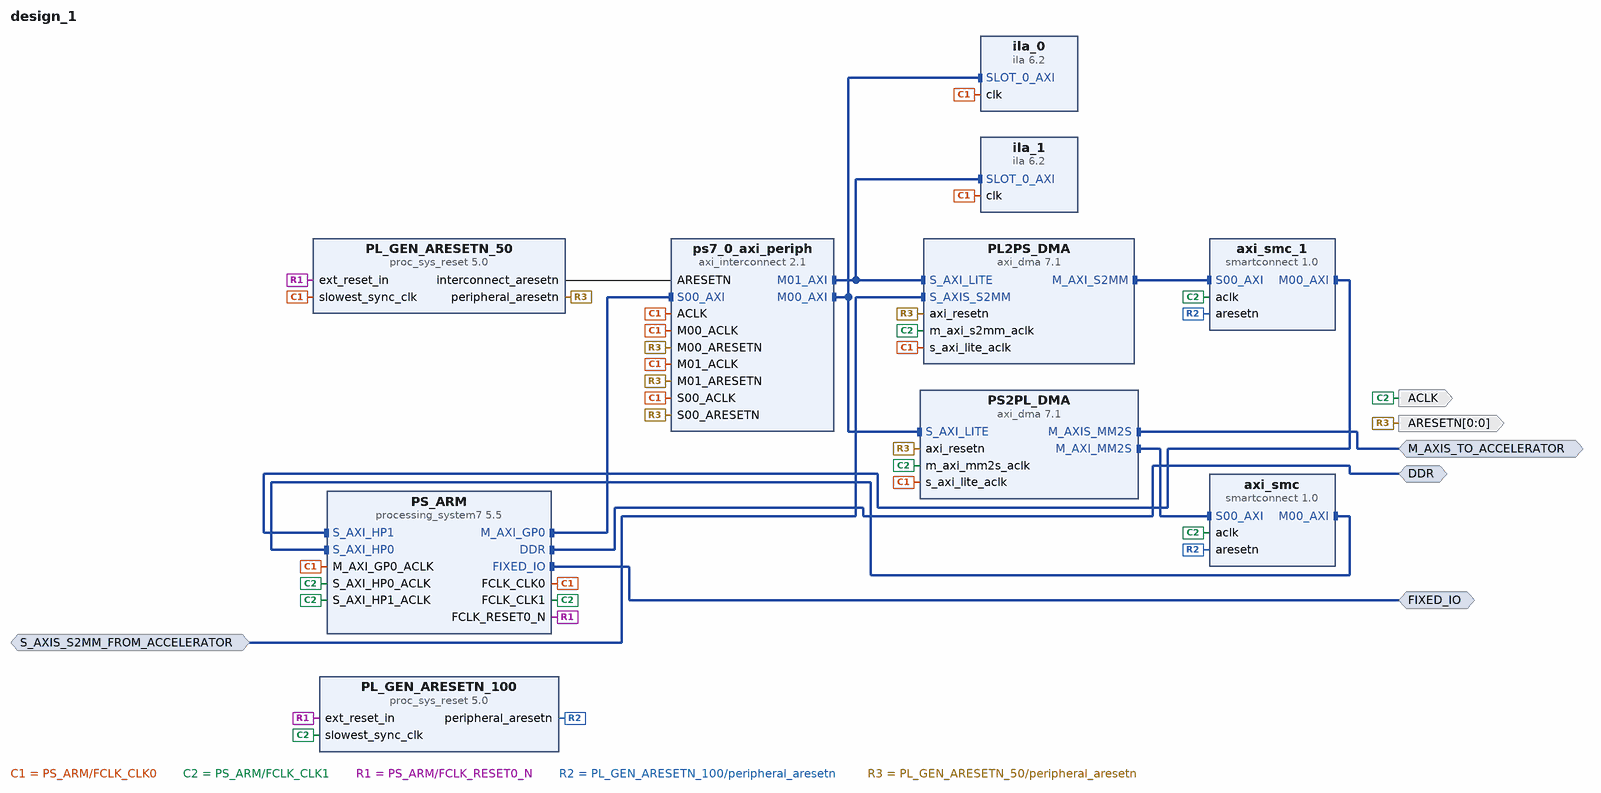
[diagram p0: block diagram of the top level]
# Vivado block design design_1, xc7z010clg400-1, Vivado 2022.2.2
create_bd_design design_1

create_bd_intf_port -mode Master -vlnv xilinx.com:interface:ddrx_rtl:1.0 DDR
create_bd_intf_port -mode Master -vlnv xilinx.com:display_processing_system7:fixedio_rtl:1.0 FIXED_IO
create_bd_intf_port -mode Master -vlnv xilinx.com:interface:axis_rtl:1.0 M_AXIS_TO_ACCELERATOR
create_bd_intf_port -mode Slave -vlnv xilinx.com:interface:axis_rtl:1.0 S_AXIS_S2MM_FROM_ACCELERATOR
set_property -dict [list \
  CONFIG.HAS_TKEEP 1 \
  CONFIG.HAS_TLAST 1 \
  CONFIG.HAS_TREADY 1 \
  CONFIG.HAS_TSTRB 0 \
  CONFIG.LAYERED_METADATA undef \
  CONFIG.TDATA_NUM_BYTES 4 \
  CONFIG.TDEST_WIDTH 0 \
  CONFIG.TID_WIDTH 0 \
  CONFIG.TUSER_WIDTH 0 \
] [get_bd_intf_ports S_AXIS_S2MM_FROM_ACCELERATOR]
create_bd_port -dir O -type clk ACLK
set_property -dict {CONFIG.ASSOCIATED_BUSIF M_AXIS_TO_ACCELERATOR:S_AXIS_S2MM_FROM_ACCELERATOR} [get_bd_ports ACLK]
create_bd_port -dir O -from 0 -to 0 -type rst ARESETN

create_bd_cell -type ip -vlnv xilinx.com:ip:axi_dma:7.1 PL2PS_DMA
set_property -dict [list \
  CONFIG.c_addr_width 64 \
  CONFIG.c_include_mm2s 0 \
  CONFIG.c_include_sg 0 \
  CONFIG.c_s2mm_burst_size 256 \
  CONFIG.c_sg_length_width 26 \
] [get_bd_cells PL2PS_DMA]
create_bd_cell -type ip -vlnv xilinx.com:ip:proc_sys_reset:5.0 PL_GEN_ARESETN_50
create_bd_cell -type ip -vlnv xilinx.com:ip:proc_sys_reset:5.0 PL_GEN_ARESETN_100
create_bd_cell -type ip -vlnv xilinx.com:ip:axi_dma:7.1 PS2PL_DMA
set_property -dict [list \
  CONFIG.c_addr_width 64 \
  CONFIG.c_include_s2mm 0 \
  CONFIG.c_include_sg 0 \
  CONFIG.c_m_axi_mm2s_data_width 64 \
  CONFIG.c_m_axis_mm2s_tdata_width 8 \
  CONFIG.c_mm2s_burst_size 256 \
  CONFIG.c_sg_length_width 26 \
] [get_bd_cells PS2PL_DMA]
create_bd_cell -type ip -vlnv xilinx.com:ip:processing_system7:5.5 PS_ARM
set_property -dict [list \
  CONFIG.PCW_APU_PERIPHERAL_FREQMHZ 650 \
  CONFIG.PCW_CRYSTAL_PERIPHERAL_FREQMHZ 50.000000 \
  CONFIG.PCW_ENET0_ENET0_IO {MIO 16 .. 27} \
  CONFIG.PCW_ENET0_GRP_MDIO_ENABLE 1 \
  CONFIG.PCW_ENET0_GRP_MDIO_IO EMIO \
  CONFIG.PCW_ENET0_PERIPHERAL_ENABLE 1 \
  CONFIG.PCW_ENET0_RESET_ENABLE 0 \
  CONFIG.PCW_ENET_RESET_ENABLE 1 \
  CONFIG.PCW_ENET_RESET_SELECT {Share reset pin} \
  CONFIG.PCW_EN_CLK1_PORT 1 \
  CONFIG.PCW_FCLK_CLK1_BUF TRUE \
  CONFIG.PCW_FPGA0_PERIPHERAL_FREQMHZ 50 \
  CONFIG.PCW_FPGA1_PERIPHERAL_FREQMHZ 100 \
  CONFIG.PCW_FPGA_FCLK1_ENABLE 1 \
  CONFIG.PCW_GPIO_MIO_GPIO_ENABLE 1 \
  CONFIG.PCW_GPIO_MIO_GPIO_IO MIO \
  CONFIG.PCW_I2C_RESET_ENABLE 1 \
  CONFIG.PCW_PRESET_BANK1_VOLTAGE {LVCMOS 1.8V} \
  CONFIG.PCW_QSPI_GRP_FBCLK_ENABLE 1 \
  CONFIG.PCW_QSPI_GRP_FBCLK_IO {MIO 8} \
  CONFIG.PCW_QSPI_GRP_SINGLE_SS_ENABLE 1 \
  CONFIG.PCW_QSPI_GRP_SINGLE_SS_IO {MIO 1 .. 6} \
  CONFIG.PCW_QSPI_PERIPHERAL_ENABLE 1 \
  CONFIG.PCW_QSPI_QSPI_IO {MIO 1 .. 6} \
  CONFIG.PCW_SD0_GRP_CD_ENABLE 1 \
  CONFIG.PCW_SD0_GRP_CD_IO {MIO 47} \
  CONFIG.PCW_SD0_GRP_WP_ENABLE 1 \
  CONFIG.PCW_SD0_GRP_WP_IO EMIO \
  CONFIG.PCW_SD0_PERIPHERAL_ENABLE 1 \
  CONFIG.PCW_SD0_SD0_IO {MIO 40 .. 45} \
  CONFIG.PCW_SDIO_PERIPHERAL_FREQMHZ 50 \
  CONFIG.PCW_SINGLE_QSPI_DATA_MODE x4 \
  CONFIG.PCW_UART1_PERIPHERAL_ENABLE 1 \
  CONFIG.PCW_UART1_UART1_IO {MIO 48 .. 49} \
  CONFIG.PCW_UART_PERIPHERAL_FREQMHZ 100 \
  CONFIG.PCW_UIPARAM_DDR_FREQ_MHZ 525 \
  CONFIG.PCW_UIPARAM_DDR_PARTNO {MT41K128M16 JT-125} \
  CONFIG.PCW_USB0_PERIPHERAL_ENABLE 1 \
  CONFIG.PCW_USB0_RESET_ENABLE 1 \
  CONFIG.PCW_USB0_RESET_IO {MIO 46} \
  CONFIG.PCW_USB0_USB0_IO {MIO 28 .. 39} \
  CONFIG.PCW_USB_RESET_ENABLE 1 \
  CONFIG.PCW_USB_RESET_SELECT {Share reset pin} \
  CONFIG.PCW_USE_S_AXI_HP0 1 \
  CONFIG.PCW_USE_S_AXI_HP1 1 \
] [get_bd_cells PS_ARM]
# 216 more settings of PS_ARM are not shown: defaults, MIO pin electricals, DDR timing, and values the tool derives
create_bd_cell -type ip -vlnv xilinx.com:ip:smartconnect:1.0 axi_smc
set_property -dict {CONFIG.NUM_SI 1} [get_bd_cells axi_smc]
create_bd_cell -type ip -vlnv xilinx.com:ip:smartconnect:1.0 axi_smc_1
set_property -dict {CONFIG.NUM_SI 1} [get_bd_cells axi_smc_1]
create_bd_cell -type ip -vlnv xilinx.com:ip:axi_interconnect:2.1 ps7_0_axi_periph
set_property -dict {CONFIG.NUM_MI 2} [get_bd_cells ps7_0_axi_periph]
create_bd_cell -type ip -vlnv xilinx.com:ip:ila:6.2 ila_0
create_bd_cell -type ip -vlnv xilinx.com:ip:ila:6.2 ila_1

# ---- connections ----

connect_bd_intf_net [get_bd_intf_pins PL2PS_DMA/M_AXI_S2MM] [get_bd_intf_pins axi_smc_1/S00_AXI]
connect_bd_intf_net [get_bd_intf_ports M_AXIS_TO_ACCELERATOR] [get_bd_intf_pins PS2PL_DMA/M_AXIS_MM2S]
connect_bd_intf_net [get_bd_intf_pins PS2PL_DMA/M_AXI_MM2S] [get_bd_intf_pins axi_smc/S00_AXI]
connect_bd_intf_net -intf_net S_AXIS_S2MM_0_1 [get_bd_intf_ports S_AXIS_S2MM_FROM_ACCELERATOR] [get_bd_intf_pins PL2PS_DMA/S_AXIS_S2MM]
connect_bd_intf_net [get_bd_intf_pins PS_ARM/S_AXI_HP1] [get_bd_intf_pins axi_smc_1/M00_AXI]
connect_bd_intf_net [get_bd_intf_pins PS_ARM/S_AXI_HP0] [get_bd_intf_pins axi_smc/M00_AXI]
connect_bd_intf_net -intf_net processing_system7_0_DDR [get_bd_intf_ports DDR] [get_bd_intf_pins PS_ARM/DDR]
connect_bd_intf_net -intf_net processing_system7_0_FIXED_IO [get_bd_intf_ports FIXED_IO] [get_bd_intf_pins PS_ARM/FIXED_IO]
connect_bd_intf_net -intf_net processing_system7_0_M_AXI_GP0 [get_bd_intf_pins PS_ARM/M_AXI_GP0] [get_bd_intf_pins ps7_0_axi_periph/S00_AXI]
connect_bd_intf_net [get_bd_intf_pins PS2PL_DMA/S_AXI_LITE] [get_bd_intf_pins ps7_0_axi_periph/M00_AXI]
connect_bd_intf_net [get_bd_intf_pins PS2PL_DMA/S_AXI_LITE] [get_bd_intf_pins ila_0/SLOT_0_AXI]
connect_bd_intf_net [get_bd_intf_pins PL2PS_DMA/S_AXI_LITE] [get_bd_intf_pins ps7_0_axi_periph/M01_AXI]
connect_bd_intf_net [get_bd_intf_pins PL2PS_DMA/S_AXI_LITE] [get_bd_intf_pins ila_1/SLOT_0_AXI]
connect_bd_net -net processing_system7_0_FCLK_CLK0 [get_bd_pins PS_ARM/FCLK_CLK0] \
  [get_bd_pins PL2PS_DMA/s_axi_lite_aclk] [get_bd_pins PL_GEN_ARESETN_50/slowest_sync_clk] \
  [get_bd_pins PS2PL_DMA/s_axi_lite_aclk] [get_bd_pins PS_ARM/M_AXI_GP0_ACLK] [get_bd_pins ps7_0_axi_periph/ACLK] \
  [get_bd_pins ps7_0_axi_periph/M00_ACLK] [get_bd_pins ps7_0_axi_periph/M01_ACLK] [get_bd_pins ps7_0_axi_periph/S00_ACLK] \
  [get_bd_pins ila_1/clk] [get_bd_pins ila_0/clk]
connect_bd_net -net processing_system7_0_FCLK_CLK1 [get_bd_pins PS_ARM/FCLK_CLK1] \
  [get_bd_ports ACLK] [get_bd_pins PL2PS_DMA/m_axi_s2mm_aclk] [get_bd_pins PL_GEN_ARESETN_100/slowest_sync_clk] \
  [get_bd_pins PS2PL_DMA/m_axi_mm2s_aclk] [get_bd_pins PS_ARM/S_AXI_HP0_ACLK] [get_bd_pins PS_ARM/S_AXI_HP1_ACLK] \
  [get_bd_pins axi_smc/aclk] [get_bd_pins axi_smc_1/aclk]
connect_bd_net -net processing_system7_0_FCLK_RESET0_N [get_bd_pins PS_ARM/FCLK_RESET0_N] \
  [get_bd_pins PL_GEN_ARESETN_100/ext_reset_in] [get_bd_pins PL_GEN_ARESETN_50/ext_reset_in]
connect_bd_net -net rst_ps7_0_100M_peripheral_aresetn [get_bd_pins PL_GEN_ARESETN_100/peripheral_aresetn] \
  [get_bd_pins axi_smc/aresetn] [get_bd_pins axi_smc_1/aresetn]
connect_bd_net -net rst_ps7_0_50M_interconnect_aresetn [get_bd_pins PL_GEN_ARESETN_50/interconnect_aresetn] [get_bd_pins ps7_0_axi_periph/ARESETN]
connect_bd_net -net rst_ps7_0_50M_peripheral_aresetn [get_bd_pins PL_GEN_ARESETN_50/peripheral_aresetn] \
  [get_bd_ports ARESETN] [get_bd_pins PL2PS_DMA/axi_resetn] [get_bd_pins PS2PL_DMA/axi_resetn] \
  [get_bd_pins ps7_0_axi_periph/M00_ARESETN] [get_bd_pins ps7_0_axi_periph/M01_ARESETN] \
  [get_bd_pins ps7_0_axi_periph/S00_ARESETN]

# ---- address map ----
assign_bd_address -offset 0x0000000000000000 -range 512M -target_address_space [get_bd_addr_spaces PL2PS_DMA/Data_S2MM] [get_bd_addr_segs PS_ARM/S_AXI_HP1/HP1_DDR_LOWOCM]
assign_bd_address -offset 0x0000000000000000 -range 512M -target_address_space [get_bd_addr_spaces PS2PL_DMA/Data_MM2S] [get_bd_addr_segs PS_ARM/S_AXI_HP0/HP0_DDR_LOWOCM]
assign_bd_address -offset 0x40400000 -range 64K -target_address_space [get_bd_addr_spaces PS_ARM/Data] [get_bd_addr_segs PS2PL_DMA/S_AXI_LITE/Reg]
assign_bd_address -offset 0x40410000 -range 64K -target_address_space [get_bd_addr_spaces PS_ARM/Data] [get_bd_addr_segs PL2PS_DMA/S_AXI_LITE/Reg]

validate_bd_design
save_bd_design
